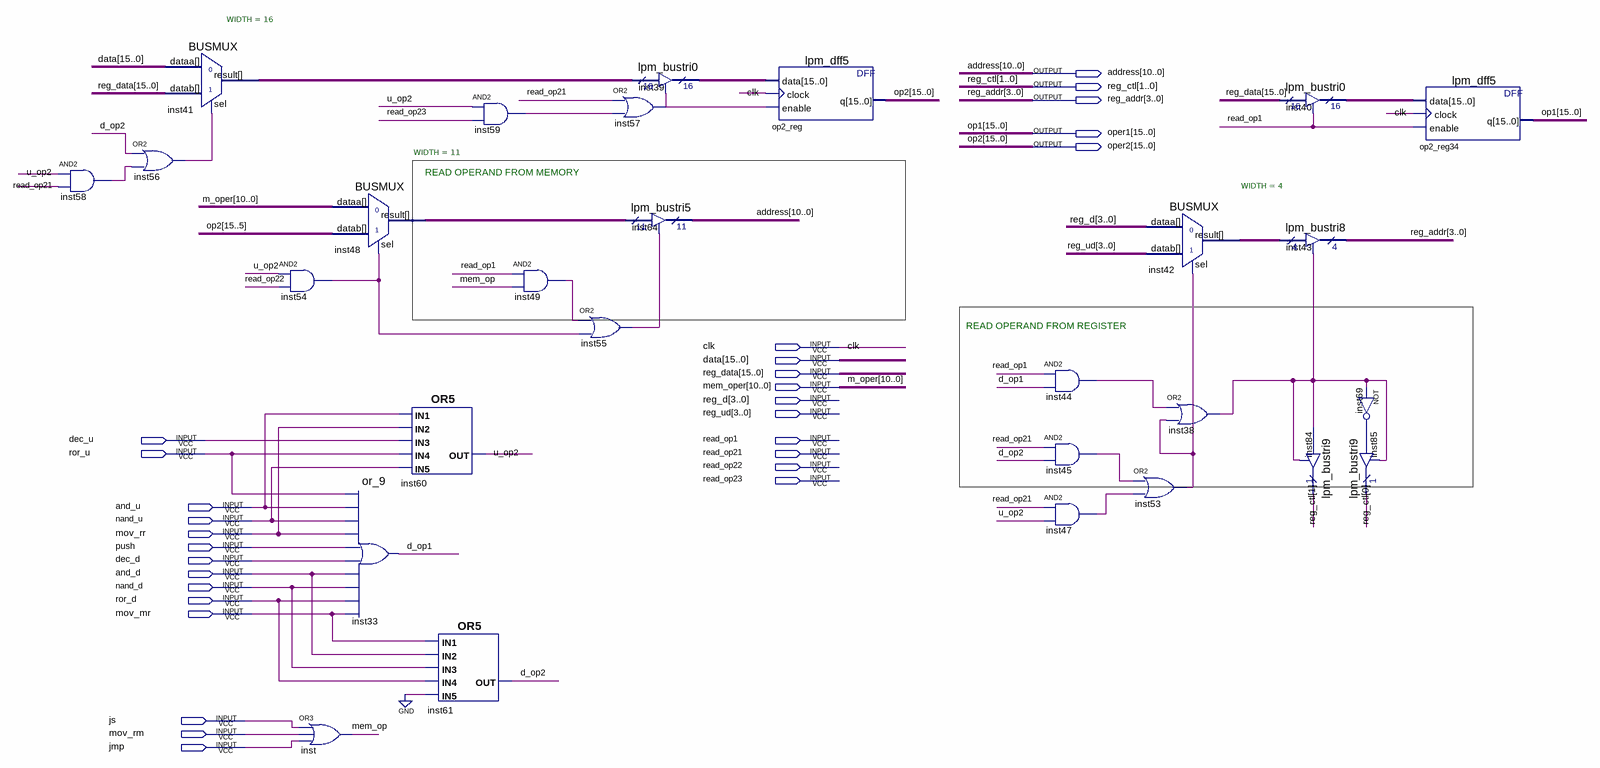
[diagram p0: schematic sheet]
// Quartus schematic op_f.bdf as structural Verilog: 28 symbols, 29 pins
module op_f (
  input  clk,
  input  [15:0] data,
  input  [15:0] reg_data,
  input  [10:0] mem_oper,
  input  [3:0] reg_d,
  input  [3:0] reg_ud,
  input  dec_u,
  input  read_op1,
  input  ror_u,
  input  read_op21,
  input  read_op22,
  input  read_op23,
  input  and_u,
  input  nand_u,
  input  mov_rr,
  input  push,
  input  dec_d,
  input  and_d,
  input  nand_d,
  input  ror_d,
  input  mov_mr,
  input  js,
  input  mov_rm,
  input  jmp,
  output [10:0] address,
  output [1:0] reg_ctl,
  output [3:0] reg_addr,
  output [15:0] oper1,
  output [15:0] oper2
);

  wire d_op1, d_op2, inst38_out, inst44_out, inst45_out, inst47_out, inst49_out, inst53_out, inst54_out,
       inst55_out, inst56_out, inst57_out, inst58_out, inst59_out, inst69_out, mem_op, u_op2;
  wire [3:0] inst42_result;
  wire [10:0] inst48_result;
  wire [15:0] inst39_tridata, inst40_tridata, inst41_result;

  and inst58 (inst58_out, u_op2, read_op21);
  or inst56 (inst56_out, d_op2, inst58_out);
  BUSMUX #(.WIDTH(16)) inst41 (.datab(reg_data), .sel(inst56_out), .dataa(data), .result(inst41_result));
  and inst54 (inst54_out, u_op2, read_op22);
  BUSMUX #(.WIDTH(11)) inst48 (.datab(oper2[15:5]), .sel(inst54_out), .dataa(mem_oper), .result(inst48_result));
  or_9 inst33 (
    .data0(ror_u), .data1(and_u), .data2(nand_u), .data3(mov_rr), .data4(push), .data5(dec_d), .data6(and_d),
    .data7(nand_d), .data8(ror_d), .data9(mov_mr), .result(d_op1));
  or inst (mem_op, js, mov_rm, jmp);
  or inst60 (u_op2, and_u, mov_rr, dec_u, ror_u, nand_u);
  or inst61 (d_op2, mov_mr, and_d, nand_d, ror_d, 1'b0);
  and inst59 (inst59_out, u_op2, read_op23);
  and inst49 (inst49_out, read_op1, mem_op);
  or inst57 (inst57_out, read_op21, inst59_out);
  or inst55 (inst55_out, inst49_out, inst54_out);
  lpm_bustri0 inst39 (.enabledt(inst57_out), .data(inst41_result), .tridata(inst39_tridata));
  lpm_bustri5 inst64 (.enabledt(inst55_out), .data(inst48_result), .tridata(address));
  lpm_dff5 op2_reg (.data(inst39_tridata), .clock(clk), .enable(inst57_out), .q(oper2));
  and inst44 (inst44_out, read_op1, d_op1);
  and inst45 (inst45_out, read_op21, d_op2);
  and inst47 (inst47_out, read_op21, u_op2);
  BUSMUX #(.WIDTH(4)) inst42 (.datab(reg_ud), .sel(inst53_out), .dataa(reg_d), .result(inst42_result));
  or inst53 (inst53_out, inst45_out, inst47_out);
  or inst38 (inst38_out, inst44_out, inst53_out);
  lpm_bustri0 inst40 (.enabledt(read_op1), .data(reg_data), .tridata(inst40_tridata));
  lpm_bustri8 inst43 (.enabledt(inst38_out), .data(inst42_result), .tridata(reg_addr));
  lpm_bustri9 inst84 (.enabledt(inst38_out), .data(inst38_out), .tridata(reg_ctl[1]));
  not inst69 (inst69_out, inst38_out);
  lpm_bustri9 inst85 (.enabledt(inst38_out), .data(inst69_out), .tridata(reg_ctl[0]));
  lpm_dff5 op2_reg34 (.data(inst40_tridata), .clock(clk), .enable(read_op1), .q(oper1));

  // Other names for the same wires on the sheet: m_oper[10:0] = mem_oper; op1[15:0] = oper1; op2[15:0] = oper2

  // Notes on the sheet:
  //   READ OPERAND FROM MEMORY
  //   READ OPERAND FROM REGISTER
endmodule
